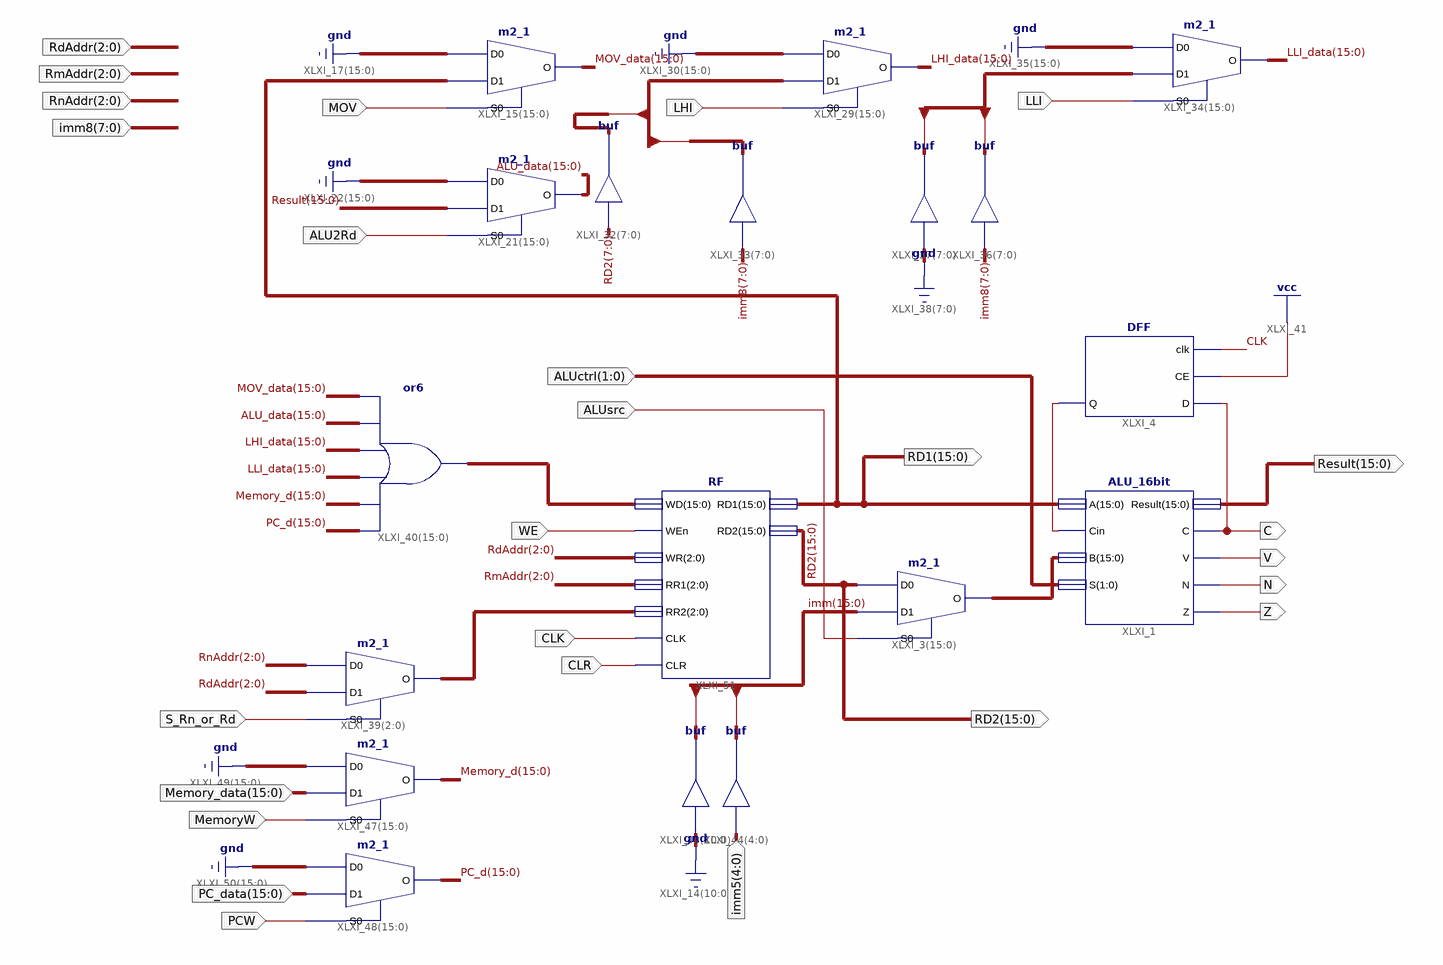
[diagram p0: schematic sheet 1]
// Xilinx ISE schematic RF_ALU.sch (artix7) as structural Verilog: 18 symbols, 26 ports
module RF_ALU (
  input  [1:0] ALUctrl,
  input  ALUsrc,
  input  [2:0] RdAddr,
  input  [2:0] RnAddr,
  input  [2:0] RmAddr,
  input  [7:0] imm8,
  input  MOV,
  input  ALU2Rd,
  input  LHI,
  input  LLI,
  input  WE,
  input  CLK,
  input  S_Rn_or_Rd,
  input  [4:0] imm5,
  input  PCW,
  input  MemoryW,
  input  [15:0] Memory_data,
  input  [15:0] PC_data,
  input  CLR,
  output [15:0] RD2,
  output C,
  output V,
  output N,
  output Z,
  output [15:0] RD1,
  output [15:0] Result
);

  wire XLXN_11;
  wire [2:0] XLXN_108;
  wire [15:0] aa, ALU_data, imm, LHI_data, LLI_data, Memory_d, MOV_data, PC_d, qq, XLXN_1, XLXN_143;

  ALU_16bit XLXI_1 (.A(RD1), .B(XLXN_1), .C(C), .Cin(XLXN_11), .N(N), .Result(Result), .S(ALUctrl), .V(V), .Z(Z));
  DFF XLXI_4 (.CE(1'b1), .clk(CLK), .D(C), .Q(XLXN_11));
  m2_1 XLXI_3[15:0] (.D0(RD2), .D1(imm), .S0(ALUsrc), .O(XLXN_1));
  m2_1 XLXI_15[15:0] (.D0({16{1'b0}}), .D1(RD1), .S0(MOV), .O(MOV_data));
  m2_1 XLXI_21[15:0] (.D0({16{1'b0}}), .D1(Result), .S0(ALU2Rd), .O(ALU_data));
  m2_1 XLXI_29[15:0] (.D0({16{1'b0}}), .D1(qq), .S0(LHI), .O(LHI_data));
  assign qq[7:0] = RD2[7:0];  // buf XLXI_32[7..0], 8 bits wide
  m2_1 XLXI_34[15:0] (.D0({16{1'b0}}), .D1(aa), .S0(LLI), .O(LLI_data));
  assign aa[7:0] = imm8;  // buf XLXI_36[7..0], 8 bits wide
  assign aa[15:8] = {8{1'b0}};  // buf XLXI_37[7..0], 8 bits wide
  assign XLXN_143 = PC_d | Memory_d | LLI_data | LHI_data | ALU_data | MOV_data;  // or6 XLXI_40[15..0], 16 bits wide
  m2_1 XLXI_39[2:0] (.D0(RnAddr), .D1(RdAddr), .S0(S_Rn_or_Rd), .O(XLXN_108));
  assign imm[15:5] = {11{1'b0}};  // buf XLXI_43[10..0], 11 bits wide
  assign imm[4:0] = imm5;  // buf XLXI_44[4..0], 5 bits wide
  assign qq[15:8] = imm8;  // buf XLXI_33[7..0], 8 bits wide
  m2_1 XLXI_47[15:0] (.D0({16{1'b0}}), .D1(Memory_data), .S0(MemoryW), .O(Memory_d));
  m2_1 XLXI_48[15:0] (.D0({16{1'b0}}), .D1(PC_data), .S0(PCW), .O(PC_d));
  RF XLXI_51 (
    .CLK(CLK), .CLR(CLR), .RD1(RD1), .RD2(RD2), .RR1(RmAddr), .RR2(XLXN_108), .WD(XLXN_143), .WEn(WE),
    .WR(RdAddr));
endmodule
